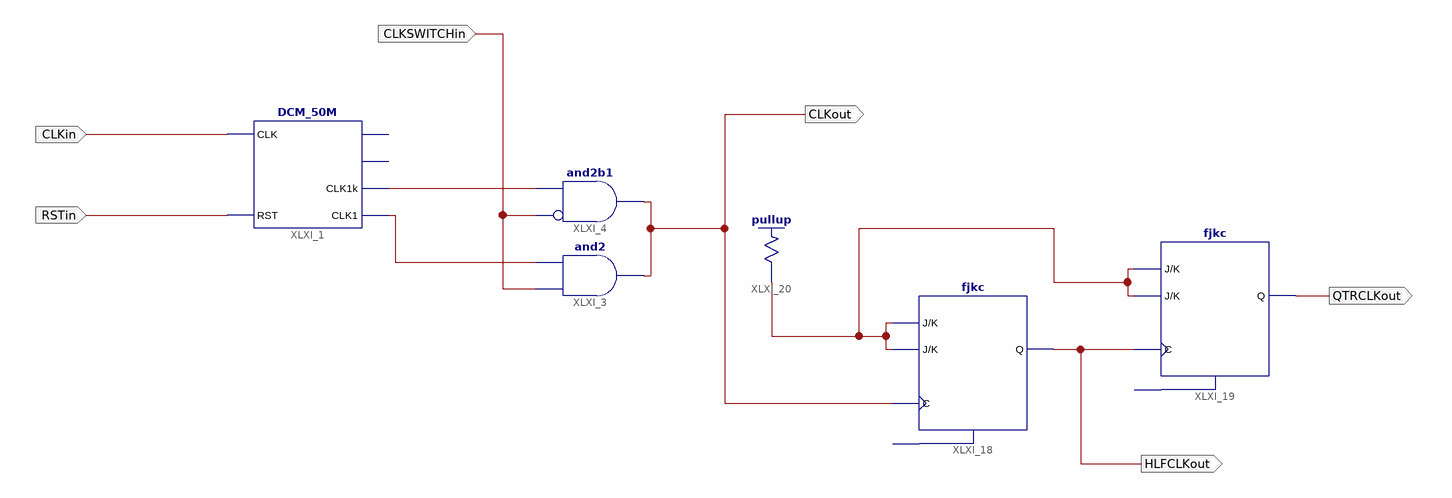
[diagram p0: schematic sheet 1]
// Xilinx ISE schematic Clock.sch (spartan3e) as structural Verilog: 6 symbols, 6 ports
module Clock (
  input  RSTin,
  input  CLKin,
  input  CLKSWITCHin,
  output CLKout,
  output HLFCLKout,
  output QTRCLKout
);

  wire XLXN_15, XLXN_22, XLXN_71;

  DCM_50M XLXI_1 (.CLK(CLKin), .RST(RSTin), .CLK1k(XLXN_15), .CLK1(XLXN_22));  // open: CLK1M, CLK10k
  and XLXI_4 (CLKout, ~CLKSWITCHin, XLXN_15);  // and2b1
  and XLXI_3 (CLKout, CLKSWITCHin, XLXN_22);
  fjkc XLXI_18 (.C(CLKout), .J(XLXN_71), .K(XLXN_71), .Q(HLFCLKout));  // open: CLR
  fjkc XLXI_19 (.C(HLFCLKout), .J(XLXN_71), .K(XLXN_71), .Q(QTRCLKout));  // open: CLR
  \pullup  XLXI_20 (.O(XLXN_71));
endmodule
